# Altium project Redpine.PrjPCB
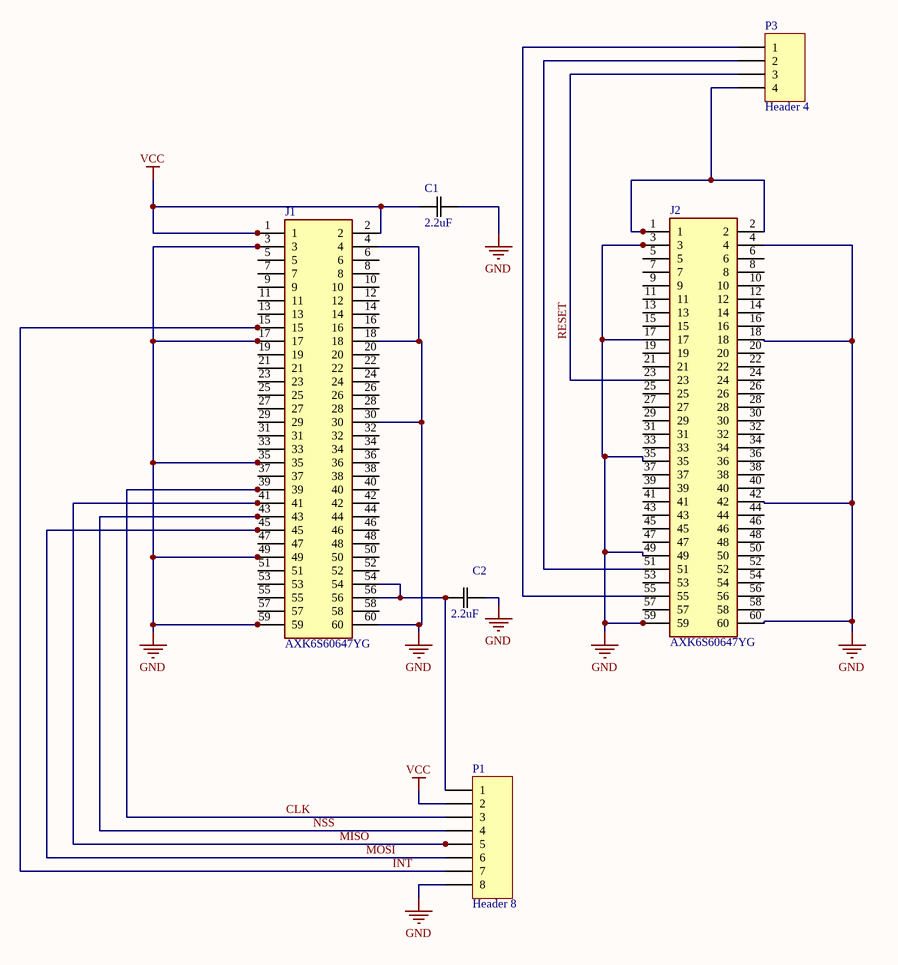
[diagram p0: wifi_breakout_SCH.SchDoc]
1 sheet, 6 parts. Net scope: global (net labels, ports and power ports of the same name join across sheets).
Board file: wifi_breakout_PCB.PcbDoc

## Sheet wifi_breakout_SCH.SchDoc
size E

### Parts
C1  2.2uF  [0805]
C2  2.2uF  [0805]
J1  AXK6S60647YG  [AXK6S60647YG]
J2  AXK6S60647YG  [AXK6S60647YG]
P1  Header 8  [HDR1X8]
P3  Header 4  [HDR1X4]

### Nets
GND: C1.2(C2) C2.2(C2) J1.3 J1.4 J1.17 J1.18 J1.30 J1.35 J1.49 J1.59 J1.60 J2.3 J2.4 J2.17 J2.18 J2.35 J2.42 J2.49 J2.59 J2.60 P1.8
VCC: C1.1(C1) J1.1 J1.2 P1.2
CLK: J1.39 P1.3
INT: J1.15 P1.7
MISO: J1.41 P1.5
MOSI: J1.45 P1.6
NSS: J1.43 P1.4
RESET: J2.23 P3.3
NetC2_1: C2.1(C1) J1.54 J1.56 P1.1
NetJ2_1: J2.1 J2.2 P3.4
NetJ2_51: J2.51 P3.2
NetJ2_55: J2.55 P3.1

Not connected (* = marked no-connect by the designer): J1 5 6 7 8 9 10 11 12 13 14 16 19 20 21 22 23 24 25 26 27 28 29 31 32 33 34 36 37 38 40 42 44 46 47 48 50 51 52 53 55 57 58; J2 5 6 7 8 9 10 11 12 13 14 15 16 19 20 21 22 24 25 26 27 28 29 30 31 32 33 34 36 37 38 39 40 41 43 44 45 46 47 48 50 52 53 54 56 57 58

### Library data of the parts
C1 C2 = CAP 2.2uF 0805: CAP CER 1UF 50V X7R 0805; MP: C0805C225K4RACTU; MF: KEMET; Tolerance: 10%; Rating: 16V; Package: 0805; Price: 0,461 CAD; Value: 2.2uF; Digikey: 399-3523-1-ND; Digikey Link: https://www.digikey.ca/products/en?keywords=399-3523-1-ND
J1 J2 = AXK6S60647YG: Redpine module connector
P1 = Header 8: Header, 8-Pin; LatestRevisionDate: 17-Jul-2002; LatestRevisionNote: Re-released for DXP Platform.; Publisher: Altium Limited
P3 = Header 4: Header, 4-Pin; LatestRevisionDate: 17-Jul-2002; LatestRevisionNote: Re-released for DXP Platform.; Publisher: Altium Limited